# Altium project Capstone_Chess_Board.PrjPcb
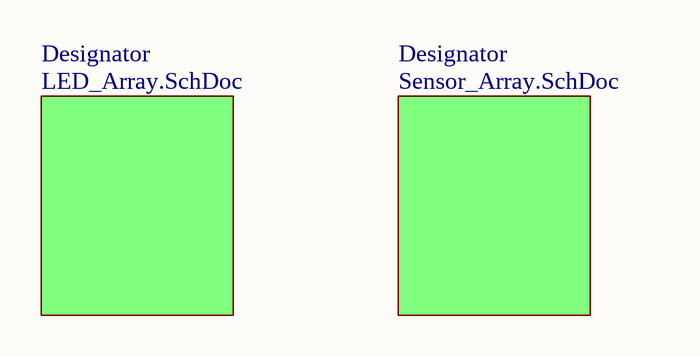
[diagram p0: Power_Supply_And_Connections.SchDoc]
3 sheets, 236 parts. Net scope: flat (ports and power ports of the same name join across sheets).
Board file: Chess_Board.PcbDoc
Sheets:
  Power_Supply_And_Connections.SchDoc
  LED_Array_Large.SchDoc
  Sensor_Array_Large.SchDoc

## Sheet Power_Supply_And_Connections.SchDoc
size A

### Sub-sheets
Designator = LED_Array.SchDoc (file not in this document): no entries
Designator = Sensor_Array.SchDoc (file not in this document): no entries

## Sheet LED_Array_Large.SchDoc
size C
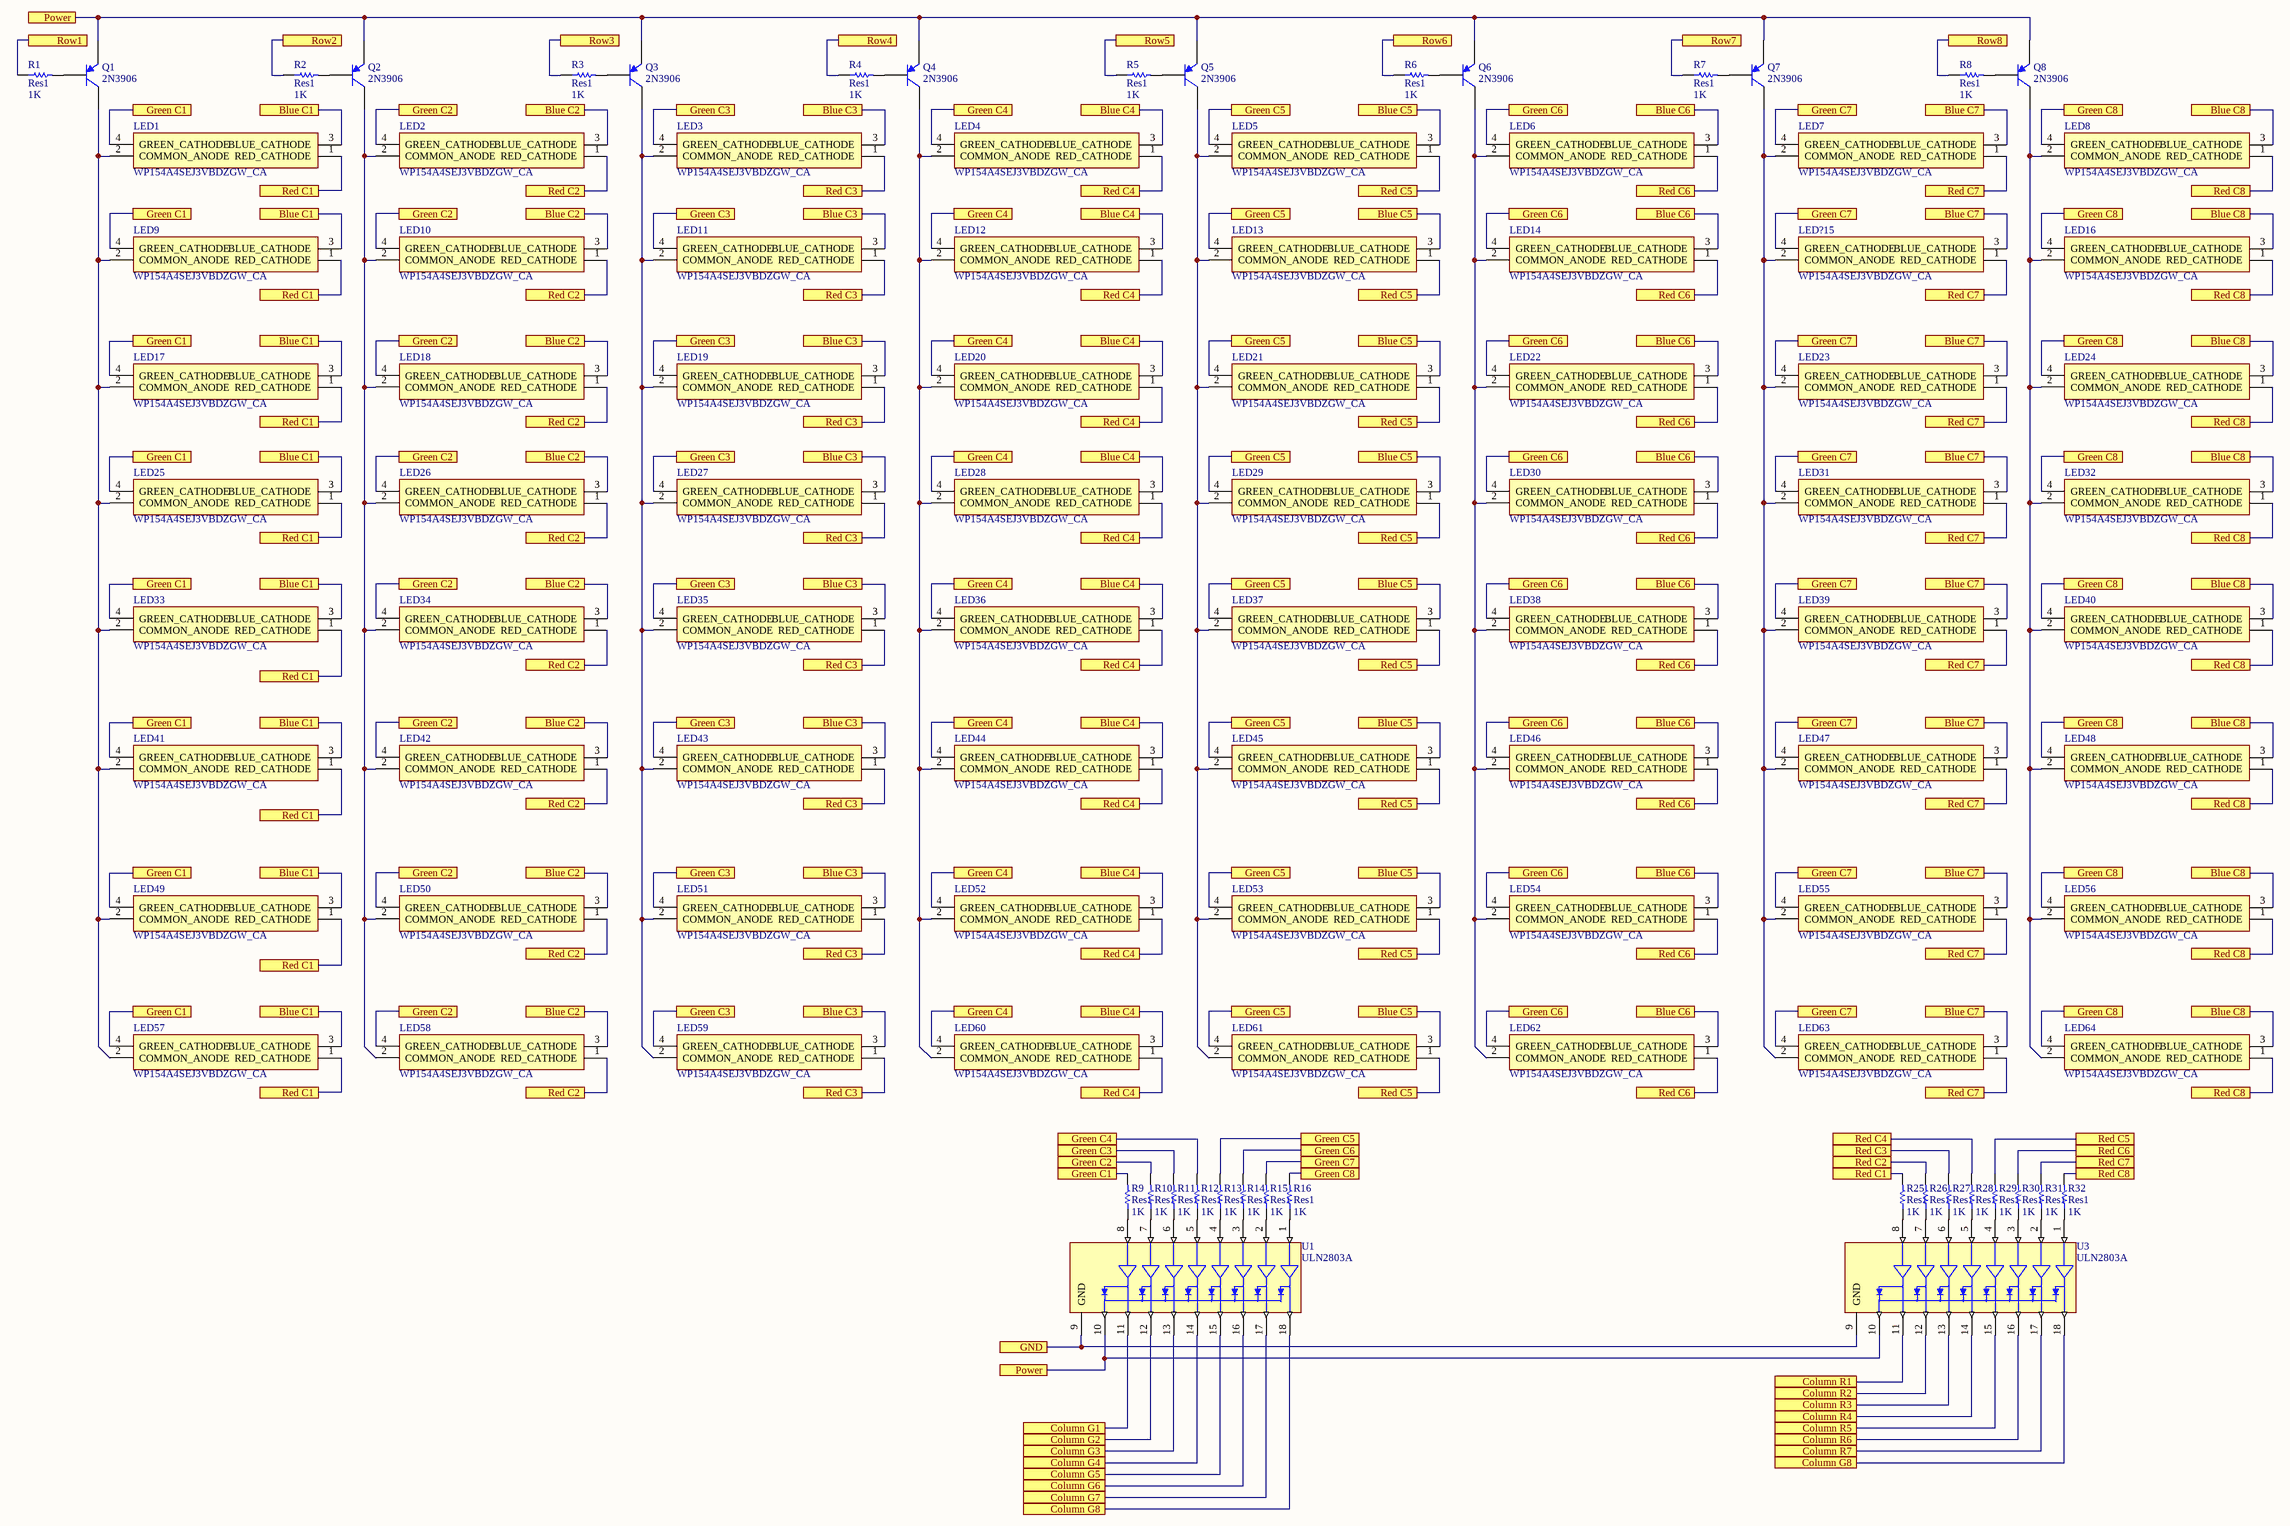
[diagram p1: LED_Array_Large.SchDoc]

### Parts
LED1  WP154A4SEJ3VBDZGW_CA  [L-154A4SUREQBFZGEC]
LED2  WP154A4SEJ3VBDZGW_CA  [L-154A4SUREQBFZGEC]
LED3  WP154A4SEJ3VBDZGW_CA  [L-154A4SUREQBFZGEC]
LED4  WP154A4SEJ3VBDZGW_CA  [L-154A4SUREQBFZGEC]
LED5  WP154A4SEJ3VBDZGW_CA  [L-154A4SUREQBFZGEC]
LED6  WP154A4SEJ3VBDZGW_CA  [L-154A4SUREQBFZGEC]
LED7  WP154A4SEJ3VBDZGW_CA  [L-154A4SUREQBFZGEC]
LED8  WP154A4SEJ3VBDZGW_CA  [L-154A4SUREQBFZGEC]
LED9  WP154A4SEJ3VBDZGW_CA  [L-154A4SUREQBFZGEC]
LED10  WP154A4SEJ3VBDZGW_CA  [L-154A4SUREQBFZGEC]
LED11  WP154A4SEJ3VBDZGW_CA  [L-154A4SUREQBFZGEC]
LED12  WP154A4SEJ3VBDZGW_CA  [L-154A4SUREQBFZGEC]
LED13  WP154A4SEJ3VBDZGW_CA  [L-154A4SUREQBFZGEC]
LED14  WP154A4SEJ3VBDZGW_CA  [L-154A4SUREQBFZGEC]
LED16  WP154A4SEJ3VBDZGW_CA  [L-154A4SUREQBFZGEC]
LED17  WP154A4SEJ3VBDZGW_CA  [L-154A4SUREQBFZGEC]
LED18  WP154A4SEJ3VBDZGW_CA  [L-154A4SUREQBFZGEC]
LED19  WP154A4SEJ3VBDZGW_CA  [L-154A4SUREQBFZGEC]
LED20  WP154A4SEJ3VBDZGW_CA  [L-154A4SUREQBFZGEC]
LED21  WP154A4SEJ3VBDZGW_CA  [L-154A4SUREQBFZGEC]
LED22  WP154A4SEJ3VBDZGW_CA  [L-154A4SUREQBFZGEC]
LED23  WP154A4SEJ3VBDZGW_CA  [L-154A4SUREQBFZGEC]
LED24  WP154A4SEJ3VBDZGW_CA  [L-154A4SUREQBFZGEC]
LED25  WP154A4SEJ3VBDZGW_CA  [L-154A4SUREQBFZGEC]
LED26  WP154A4SEJ3VBDZGW_CA  [L-154A4SUREQBFZGEC]
LED27  WP154A4SEJ3VBDZGW_CA  [L-154A4SUREQBFZGEC]
LED28  WP154A4SEJ3VBDZGW_CA  [L-154A4SUREQBFZGEC]
LED29  WP154A4SEJ3VBDZGW_CA  [L-154A4SUREQBFZGEC]
LED30  WP154A4SEJ3VBDZGW_CA  [L-154A4SUREQBFZGEC]
LED31  WP154A4SEJ3VBDZGW_CA  [L-154A4SUREQBFZGEC]
LED32  WP154A4SEJ3VBDZGW_CA  [L-154A4SUREQBFZGEC]
LED33  WP154A4SEJ3VBDZGW_CA  [L-154A4SUREQBFZGEC]
LED34  WP154A4SEJ3VBDZGW_CA  [L-154A4SUREQBFZGEC]
LED35  WP154A4SEJ3VBDZGW_CA  [L-154A4SUREQBFZGEC]
LED36  WP154A4SEJ3VBDZGW_CA  [L-154A4SUREQBFZGEC]
LED37  WP154A4SEJ3VBDZGW_CA  [L-154A4SUREQBFZGEC]
LED38  WP154A4SEJ3VBDZGW_CA  [L-154A4SUREQBFZGEC]
LED39  WP154A4SEJ3VBDZGW_CA  [L-154A4SUREQBFZGEC]
LED40  WP154A4SEJ3VBDZGW_CA  [L-154A4SUREQBFZGEC]
LED41  WP154A4SEJ3VBDZGW_CA  [L-154A4SUREQBFZGEC]
LED42  WP154A4SEJ3VBDZGW_CA  [L-154A4SUREQBFZGEC]
LED43  WP154A4SEJ3VBDZGW_CA  [L-154A4SUREQBFZGEC]
LED44  WP154A4SEJ3VBDZGW_CA  [L-154A4SUREQBFZGEC]
LED45  WP154A4SEJ3VBDZGW_CA  [L-154A4SUREQBFZGEC]
LED46  WP154A4SEJ3VBDZGW_CA  [L-154A4SUREQBFZGEC]
LED47  WP154A4SEJ3VBDZGW_CA  [L-154A4SUREQBFZGEC]
LED48  WP154A4SEJ3VBDZGW_CA  [L-154A4SUREQBFZGEC]
LED49  WP154A4SEJ3VBDZGW_CA  [L-154A4SUREQBFZGEC]
LED50  WP154A4SEJ3VBDZGW_CA  [L-154A4SUREQBFZGEC]
LED51  WP154A4SEJ3VBDZGW_CA  [L-154A4SUREQBFZGEC]
LED52  WP154A4SEJ3VBDZGW_CA  [L-154A4SUREQBFZGEC]
LED53  WP154A4SEJ3VBDZGW_CA  [L-154A4SUREQBFZGEC]
LED54  WP154A4SEJ3VBDZGW_CA  [L-154A4SUREQBFZGEC]
LED55  WP154A4SEJ3VBDZGW_CA  [L-154A4SUREQBFZGEC]
LED56  WP154A4SEJ3VBDZGW_CA  [L-154A4SUREQBFZGEC]
LED57  WP154A4SEJ3VBDZGW_CA  [L-154A4SUREQBFZGEC]
LED58  WP154A4SEJ3VBDZGW_CA  [L-154A4SUREQBFZGEC]
LED59  WP154A4SEJ3VBDZGW_CA  [L-154A4SUREQBFZGEC]
LED60  WP154A4SEJ3VBDZGW_CA  [L-154A4SUREQBFZGEC]
LED61  WP154A4SEJ3VBDZGW_CA  [L-154A4SUREQBFZGEC]
LED62  WP154A4SEJ3VBDZGW_CA  [L-154A4SUREQBFZGEC]
LED63  WP154A4SEJ3VBDZGW_CA  [L-154A4SUREQBFZGEC]
LED64  WP154A4SEJ3VBDZGW_CA  [L-154A4SUREQBFZGEC]
LED?15  WP154A4SEJ3VBDZGW_CA  [L-154A4SUREQBFZGEC]
Q1  2N3906  [TO-92A]
Q2  2N3906  [TO-92A]
Q3  2N3906  [TO-92A]
Q4  2N3906  [TO-92A]
Q5  2N3906  [TO-92A]
Q6  2N3906  [TO-92A]
Q7  2N3906  [TO-92A]
Q8  2N3906  [TO-92A]
R1  Res1  value 1K  [AXIAL-0.3]
R2  Res1  value 1K  [AXIAL-0.3]
R3  Res1  value 1K  [AXIAL-0.3]
R4  Res1  value 1K  [AXIAL-0.3]
R5  Res1  value 1K  [AXIAL-0.3]
R6  Res1  value 1K  [AXIAL-0.3]
R7  Res1  value 1K  [AXIAL-0.3]
R8  Res1  value 1K  [AXIAL-0.3]
R9  Res1  value 1K  [AXIAL-0.3]
R10  Res1  value 1K  [AXIAL-0.3]
R11  Res1  value 1K  [AXIAL-0.3]
R12  Res1  value 1K  [AXIAL-0.3]
R13  Res1  value 1K  [AXIAL-0.3]
R14  Res1  value 1K  [AXIAL-0.3]
R15  Res1  value 1K  [AXIAL-0.3]
R16  Res1  value 1K  [AXIAL-0.3]
R25  Res1  value 1K  [AXIAL-0.3]
R26  Res1  value 1K  [AXIAL-0.3]
R27  Res1  value 1K  [AXIAL-0.3]
R28  Res1  value 1K  [AXIAL-0.3]
R29  Res1  value 1K  [AXIAL-0.3]
R30  Res1  value 1K  [AXIAL-0.3]
R31  Res1  value 1K  [AXIAL-0.3]
R32  Res1  value 1K  [AXIAL-0.3]
U1  ULN2803A  [DIP850W46P254L2324H393Q18]
U3  ULN2803A  [DIP850W46P254L2324H393Q18]

### Ports
Blue C1, Blue C2, Blue C3, Blue C4, Blue C5, Blue C6, Blue C7, Blue C8, Column G1, Column G2, Column G3, Column G4, Column G5, Column G6, Column G7, Column G8, Column R1, Column R2, Column R3, Column R4, Column R5, Column R6, Column R7, GND, Green C1, Green C2, Green C3, Green C4, Green C5, Green C6, Green C7, Green C8, Power, Red C1, Red C2, Red C3, Red C4, Red C5, Red C6, Red C7, Red C8, Row1, Row2, Row3, Row4, Row5, Row6, Row7, Row8

### Nets
NetLED1_1: LED1.1(RED_CATHODE) LED9.1(RED_CATHODE) LED17.1(RED_CATHODE) LED25.1(RED_CATHODE) LED33.1(RED_CATHODE) LED41.1(RED_CATHODE) LED49.1(RED_CATHODE) LED57.1(RED_CATHODE) R25.2 ; port Red C1
NetLED1_2: LED1.2(COMMON_ANODE) LED9.2(COMMON_ANODE) LED17.2(COMMON_ANODE) LED25.2(COMMON_ANODE) LED33.2(COMMON_ANODE) LED41.2(COMMON_ANODE) LED49.2(COMMON_ANODE) LED57.2(COMMON_ANODE) Q1.3(C)
NetLED1_3: LED1.3(BLUE_CATHODE) LED9.3(BLUE_CATHODE) LED17.3(BLUE_CATHODE) LED25.3(BLUE_CATHODE) LED33.3(BLUE_CATHODE) LED41.3(BLUE_CATHODE) LED49.3(BLUE_CATHODE) LED57.3(BLUE_CATHODE) ; port Blue C1
NetLED1_4: LED1.4(GREEN_CATHODE) LED9.4(GREEN_CATHODE) LED17.4(GREEN_CATHODE) LED25.4(GREEN_CATHODE) LED33.4(GREEN_CATHODE) LED41.4(GREEN_CATHODE) LED49.4(GREEN_CATHODE) LED57.4(GREEN_CATHODE) R9.2 ; port Green C1
NetLED2_1: LED2.1(RED_CATHODE) LED10.1(RED_CATHODE) LED18.1(RED_CATHODE) LED26.1(RED_CATHODE) LED34.1(RED_CATHODE) LED42.1(RED_CATHODE) LED50.1(RED_CATHODE) LED58.1(RED_CATHODE) R26.2 ; port Red C2
NetLED2_2: LED2.2(COMMON_ANODE) LED10.2(COMMON_ANODE) LED18.2(COMMON_ANODE) LED26.2(COMMON_ANODE) LED34.2(COMMON_ANODE) LED42.2(COMMON_ANODE) LED50.2(COMMON_ANODE) LED58.2(COMMON_ANODE) Q2.3(C)
NetLED2_3: LED2.3(BLUE_CATHODE) LED10.3(BLUE_CATHODE) LED18.3(BLUE_CATHODE) LED26.3(BLUE_CATHODE) LED34.3(BLUE_CATHODE) LED42.3(BLUE_CATHODE) LED50.3(BLUE_CATHODE) LED58.3(BLUE_CATHODE) ; port Blue C2
NetLED2_4: LED2.4(GREEN_CATHODE) LED10.4(GREEN_CATHODE) LED18.4(GREEN_CATHODE) LED26.4(GREEN_CATHODE) LED34.4(GREEN_CATHODE) LED42.4(GREEN_CATHODE) LED50.4(GREEN_CATHODE) LED58.4(GREEN_CATHODE) R10.2 ; port Green C2
NetLED3_1: LED3.1(RED_CATHODE) LED11.1(RED_CATHODE) LED19.1(RED_CATHODE) LED27.1(RED_CATHODE) LED35.1(RED_CATHODE) LED43.1(RED_CATHODE) LED51.1(RED_CATHODE) LED59.1(RED_CATHODE) R27.2 ; port Red C3
NetLED3_2: LED3.2(COMMON_ANODE) LED11.2(COMMON_ANODE) LED19.2(COMMON_ANODE) LED27.2(COMMON_ANODE) LED35.2(COMMON_ANODE) LED43.2(COMMON_ANODE) LED51.2(COMMON_ANODE) LED59.2(COMMON_ANODE) Q3.3(C)
NetLED3_3: LED3.3(BLUE_CATHODE) LED11.3(BLUE_CATHODE) LED19.3(BLUE_CATHODE) LED27.3(BLUE_CATHODE) LED35.3(BLUE_CATHODE) LED43.3(BLUE_CATHODE) LED51.3(BLUE_CATHODE) LED59.3(BLUE_CATHODE) ; port Blue C3
NetLED3_4: LED3.4(GREEN_CATHODE) LED11.4(GREEN_CATHODE) LED19.4(GREEN_CATHODE) LED27.4(GREEN_CATHODE) LED35.4(GREEN_CATHODE) LED43.4(GREEN_CATHODE) LED51.4(GREEN_CATHODE) LED59.4(GREEN_CATHODE) R11.2 ; port Green C3
NetLED4_1: LED4.1(RED_CATHODE) LED12.1(RED_CATHODE) LED20.1(RED_CATHODE) LED28.1(RED_CATHODE) LED36.1(RED_CATHODE) LED44.1(RED_CATHODE) LED52.1(RED_CATHODE) LED60.1(RED_CATHODE) R28.2 ; port Red C4
NetLED4_2: LED4.2(COMMON_ANODE) LED12.2(COMMON_ANODE) LED20.2(COMMON_ANODE) LED28.2(COMMON_ANODE) LED36.2(COMMON_ANODE) LED44.2(COMMON_ANODE) LED52.2(COMMON_ANODE) LED60.2(COMMON_ANODE) Q4.3(C)
NetLED4_3: LED4.3(BLUE_CATHODE) LED12.3(BLUE_CATHODE) LED20.3(BLUE_CATHODE) LED28.3(BLUE_CATHODE) LED36.3(BLUE_CATHODE) LED44.3(BLUE_CATHODE) LED52.3(BLUE_CATHODE) LED60.3(BLUE_CATHODE) ; port Blue C4
NetLED4_4: LED4.4(GREEN_CATHODE) LED12.4(GREEN_CATHODE) LED20.4(GREEN_CATHODE) LED28.4(GREEN_CATHODE) LED36.4(GREEN_CATHODE) LED44.4(GREEN_CATHODE) LED52.4(GREEN_CATHODE) LED60.4(GREEN_CATHODE) R12.2 ; port Green C4
NetLED5_1: LED5.1(RED_CATHODE) LED13.1(RED_CATHODE) LED21.1(RED_CATHODE) LED29.1(RED_CATHODE) LED37.1(RED_CATHODE) LED45.1(RED_CATHODE) LED53.1(RED_CATHODE) LED61.1(RED_CATHODE) R29.2 ; port Red C5
NetLED5_2: LED5.2(COMMON_ANODE) LED13.2(COMMON_ANODE) LED21.2(COMMON_ANODE) LED29.2(COMMON_ANODE) LED37.2(COMMON_ANODE) LED45.2(COMMON_ANODE) LED53.2(COMMON_ANODE) LED61.2(COMMON_ANODE) Q5.3(C)
NetLED5_3: LED5.3(BLUE_CATHODE) LED13.3(BLUE_CATHODE) LED21.3(BLUE_CATHODE) LED29.3(BLUE_CATHODE) LED37.3(BLUE_CATHODE) LED45.3(BLUE_CATHODE) LED53.3(BLUE_CATHODE) LED61.3(BLUE_CATHODE) ; port Blue C5
NetLED5_4: LED5.4(GREEN_CATHODE) LED13.4(GREEN_CATHODE) LED21.4(GREEN_CATHODE) LED29.4(GREEN_CATHODE) LED37.4(GREEN_CATHODE) LED45.4(GREEN_CATHODE) LED53.4(GREEN_CATHODE) LED61.4(GREEN_CATHODE) R13.2 ; port Green C5
NetLED6_1: LED6.1(RED_CATHODE) LED14.1(RED_CATHODE) LED22.1(RED_CATHODE) LED30.1(RED_CATHODE) LED38.1(RED_CATHODE) LED46.1(RED_CATHODE) LED54.1(RED_CATHODE) LED62.1(RED_CATHODE) R30.2 ; port Red C6
NetLED6_2: LED6.2(COMMON_ANODE) LED14.2(COMMON_ANODE) LED22.2(COMMON_ANODE) LED30.2(COMMON_ANODE) LED38.2(COMMON_ANODE) LED46.2(COMMON_ANODE) LED54.2(COMMON_ANODE) LED62.2(COMMON_ANODE) Q6.3(C)
NetLED6_3: LED6.3(BLUE_CATHODE) LED14.3(BLUE_CATHODE) LED22.3(BLUE_CATHODE) LED30.3(BLUE_CATHODE) LED38.3(BLUE_CATHODE) LED46.3(BLUE_CATHODE) LED54.3(BLUE_CATHODE) LED62.3(BLUE_CATHODE) ; port Blue C6
NetLED6_4: LED6.4(GREEN_CATHODE) LED14.4(GREEN_CATHODE) LED22.4(GREEN_CATHODE) LED30.4(GREEN_CATHODE) LED38.4(GREEN_CATHODE) LED46.4(GREEN_CATHODE) LED54.4(GREEN_CATHODE) LED62.4(GREEN_CATHODE) R14.2 ; port Green C6
NetLED7_1: LED7.1(RED_CATHODE) LED23.1(RED_CATHODE) LED31.1(RED_CATHODE) LED39.1(RED_CATHODE) LED47.1(RED_CATHODE) LED55.1(RED_CATHODE) LED63.1(RED_CATHODE) LED?15.1(RED_CATHODE) R31.2 ; port Red C7
NetLED7_2: LED7.2(COMMON_ANODE) LED23.2(COMMON_ANODE) LED31.2(COMMON_ANODE) LED39.2(COMMON_ANODE) LED47.2(COMMON_ANODE) LED55.2(COMMON_ANODE) LED63.2(COMMON_ANODE) LED?15.2(COMMON_ANODE) Q7.3(C)
NetLED7_3: LED7.3(BLUE_CATHODE) LED23.3(BLUE_CATHODE) LED31.3(BLUE_CATHODE) LED39.3(BLUE_CATHODE) LED47.3(BLUE_CATHODE) LED55.3(BLUE_CATHODE) LED63.3(BLUE_CATHODE) LED?15.3(BLUE_CATHODE) ; port Blue C7
NetLED7_4: LED7.4(GREEN_CATHODE) LED23.4(GREEN_CATHODE) LED31.4(GREEN_CATHODE) LED39.4(GREEN_CATHODE) LED47.4(GREEN_CATHODE) LED55.4(GREEN_CATHODE) LED63.4(GREEN_CATHODE) LED?15.4(GREEN_CATHODE) R15.2 ; port Green C7
NetLED8_1: LED8.1(RED_CATHODE) LED16.1(RED_CATHODE) LED24.1(RED_CATHODE) LED32.1(RED_CATHODE) LED40.1(RED_CATHODE) LED48.1(RED_CATHODE) LED56.1(RED_CATHODE) LED64.1(RED_CATHODE) R32.2 ; port Red C8
NetLED8_2: LED8.2(COMMON_ANODE) LED16.2(COMMON_ANODE) LED24.2(COMMON_ANODE) LED32.2(COMMON_ANODE) LED40.2(COMMON_ANODE) LED48.2(COMMON_ANODE) LED56.2(COMMON_ANODE) LED64.2(COMMON_ANODE) Q8.3(C)
NetLED8_3: LED8.3(BLUE_CATHODE) LED16.3(BLUE_CATHODE) LED24.3(BLUE_CATHODE) LED32.3(BLUE_CATHODE) LED40.3(BLUE_CATHODE) LED48.3(BLUE_CATHODE) LED56.3(BLUE_CATHODE) LED64.3(BLUE_CATHODE) ; port Blue C8
NetLED8_4: LED8.4(GREEN_CATHODE) LED16.4(GREEN_CATHODE) LED24.4(GREEN_CATHODE) LED32.4(GREEN_CATHODE) LED40.4(GREEN_CATHODE) LED48.4(GREEN_CATHODE) LED56.4(GREEN_CATHODE) LED64.4(GREEN_CATHODE) R16.2 ; port Green C8
NetQ1_1: Q1.1(E) Q2.1(E) Q3.1(E) Q4.1(E) Q5.1(E) Q6.1(E) Q7.1(E) Q8.1(E) U1.10(COMMON) U3.10(COMMON) ; port Power
NetQ1_2: Q1.2(B) R1.2
NetQ2_2: Q2.2(B) R2.2
NetQ3_2: Q3.2(B) R3.2
NetQ4_2: Q4.2(B) R4.2
NetQ5_2: Q5.2(B) R5.2
NetQ6_2: Q6.2(B) R6.2
NetQ7_2: Q7.2(B) R7.2
NetQ8_2: Q8.2(B) R8.2
NetR1_1: R1.1 ; port Row1
NetR2_1: R2.1 ; port Row2
NetR3_1: R3.1 ; port Row3
NetR4_1: R4.1 ; port Row4
NetR5_1: R5.1 ; port Row5
NetR6_1: R6.1 ; port Row6
NetR7_1: R7.1 ; port Row7
NetR8_1: R8.1 ; port Row8
NetR9_1: R9.1 U1.8(IN_8)
NetR10_1: R10.1 U1.7(IN_7)
NetR11_1: R11.1 U1.6(IN_6)
NetR12_1: R12.1 U1.5(IN_5)
NetR13_1: R13.1 U1.4(IN_4)
NetR14_1: R14.1 U1.3(IN_3)
NetR15_1: R15.1 U1.2(IN_2)
NetR16_1: R16.1 U1.1(IN_1)
NetR25_1: R25.1 U3.8(IN_8)
NetR26_1: R26.1 U3.7(IN_7)
NetR27_1: R27.1 U3.6(IN_6)
NetR28_1: R28.1 U3.5(IN_5)
NetR29_1: R29.1 U3.4(IN_4)
NetR30_1: R30.1 U3.3(IN_3)
NetR31_1: R31.1 U3.2(IN_2)
NetR32_1: R32.1 U3.1(IN_1)
NetU1_9: U1.9(GND) U3.9(GND) ; port GND
NetU1_11: U1.11(OUT_8) ; port Column G1
NetU1_12: U1.12(OUT_7) ; port Column G2
NetU1_13: U1.13(OUT_6) ; port Column G3
NetU1_14: U1.14(OUT_5) ; port Column G4
NetU1_15: U1.15(OUT_4) ; port Column G5
NetU1_16: U1.16(OUT_3) ; port Column G6
NetU1_17: U1.17(OUT_2) ; port Column G7
NetU1_18: U1.18(OUT_1) U3.18(OUT_1) ; port Column G8
NetU3_11: U3.11(OUT_8) ; port Column R1
NetU3_12: U3.12(OUT_7) ; port Column R2
NetU3_13: U3.13(OUT_6) ; port Column R3
NetU3_14: U3.14(OUT_5) ; port Column R4
NetU3_15: U3.15(OUT_4) ; port Column R5
NetU3_16: U3.16(OUT_3) ; port Column R6
NetU3_17: U3.17(OUT_2) ; port Column R7

### Library data of the parts
LED1-LED14 LED16-LED64 LED?15 = WP154A4SEJ3VBDZGW_CA: LED; Manufacturer_Name: Kingbright; Manufacturer_Part_Number: WP154A4SEJ3VBDZGW/CA; Datasheet Link: http://www.kingbrightusa.com/images/catalog/SPEC/WP154A4SEJ3VBDZGW-CA.pdf; Mouser Part Number: 604-WP154A43VBDZGWCA; Mouser Price/Stock: https://www.mouser.co.uk/ProductDetail/Kingbright/WP154A4SEJ3VBDZGW-CA/?qs=YCa%2FAAYMW01xRqZww6UuiQ%3D%3D; Arrow Part Number: WP154A4SEJ3VBDZGW/CA; Arrow Price/Stock: https://www.arrow.com/en/products/wp154a4sej3vbdzgwca/kingbright
Q1-Q8 = 2N3906: PNP General Purpose Amplifier; Published: 8-Jun-2000; LatestRevisionDate: 15-Jan-2003; LatestRevisionNote: PCB Footprint 'BCY-W3/D4.7' replaced; DatasheetVersion: 1997; PackageVersion: Sep-1998; PackageReference: TO-92A; Publisher: Altium Limited; PackageDescription: TO, Flat Index; 3 In-Line, Axial Leads; Body Dia. 4.5mm; Leads 0.51 x 0.48 mm (max); ComponentLink1Description: Manufacturer Link; ComponentLink1URL: http://www.fairchildsemi.com/; ComponentLink2Description: Datasheet; ComponentLink2URL: http://www.fairchildsemi.com/ds/2N%2F2N3906.pdf
R1-R16 R25-R32 = Res1: Resistor; Published: 8-Jun-2000; LatestRevisionDate: 17-Jul-2002; LatestRevisionNote: Re-released for DXP Platform.; PackageReference: AXIAL-0.3; Publisher: Altium Limited; PackageDescription: Axial Device, Thru-Hole; 2 Leads; 0.3 in Pin Spacing
U1 U3 = ULN2803A: Bipolar _BJT_ Transistor Array 8 NPN Darlington 50V 500mA 2.25W Through Hole 18-DIP; MF: STMicroelectronics; Value: *; MP: ULN2803A; Package: DIP-18 STMicroelectronics; Price: None; SnapEDA_Link: https://www.snapeda.com/parts/ULN2803A/STMicroelectronics/view-part/697285/?ref=snap; Availability: Unavailable

## Sheet Sensor_Array_Large.SchDoc
size C
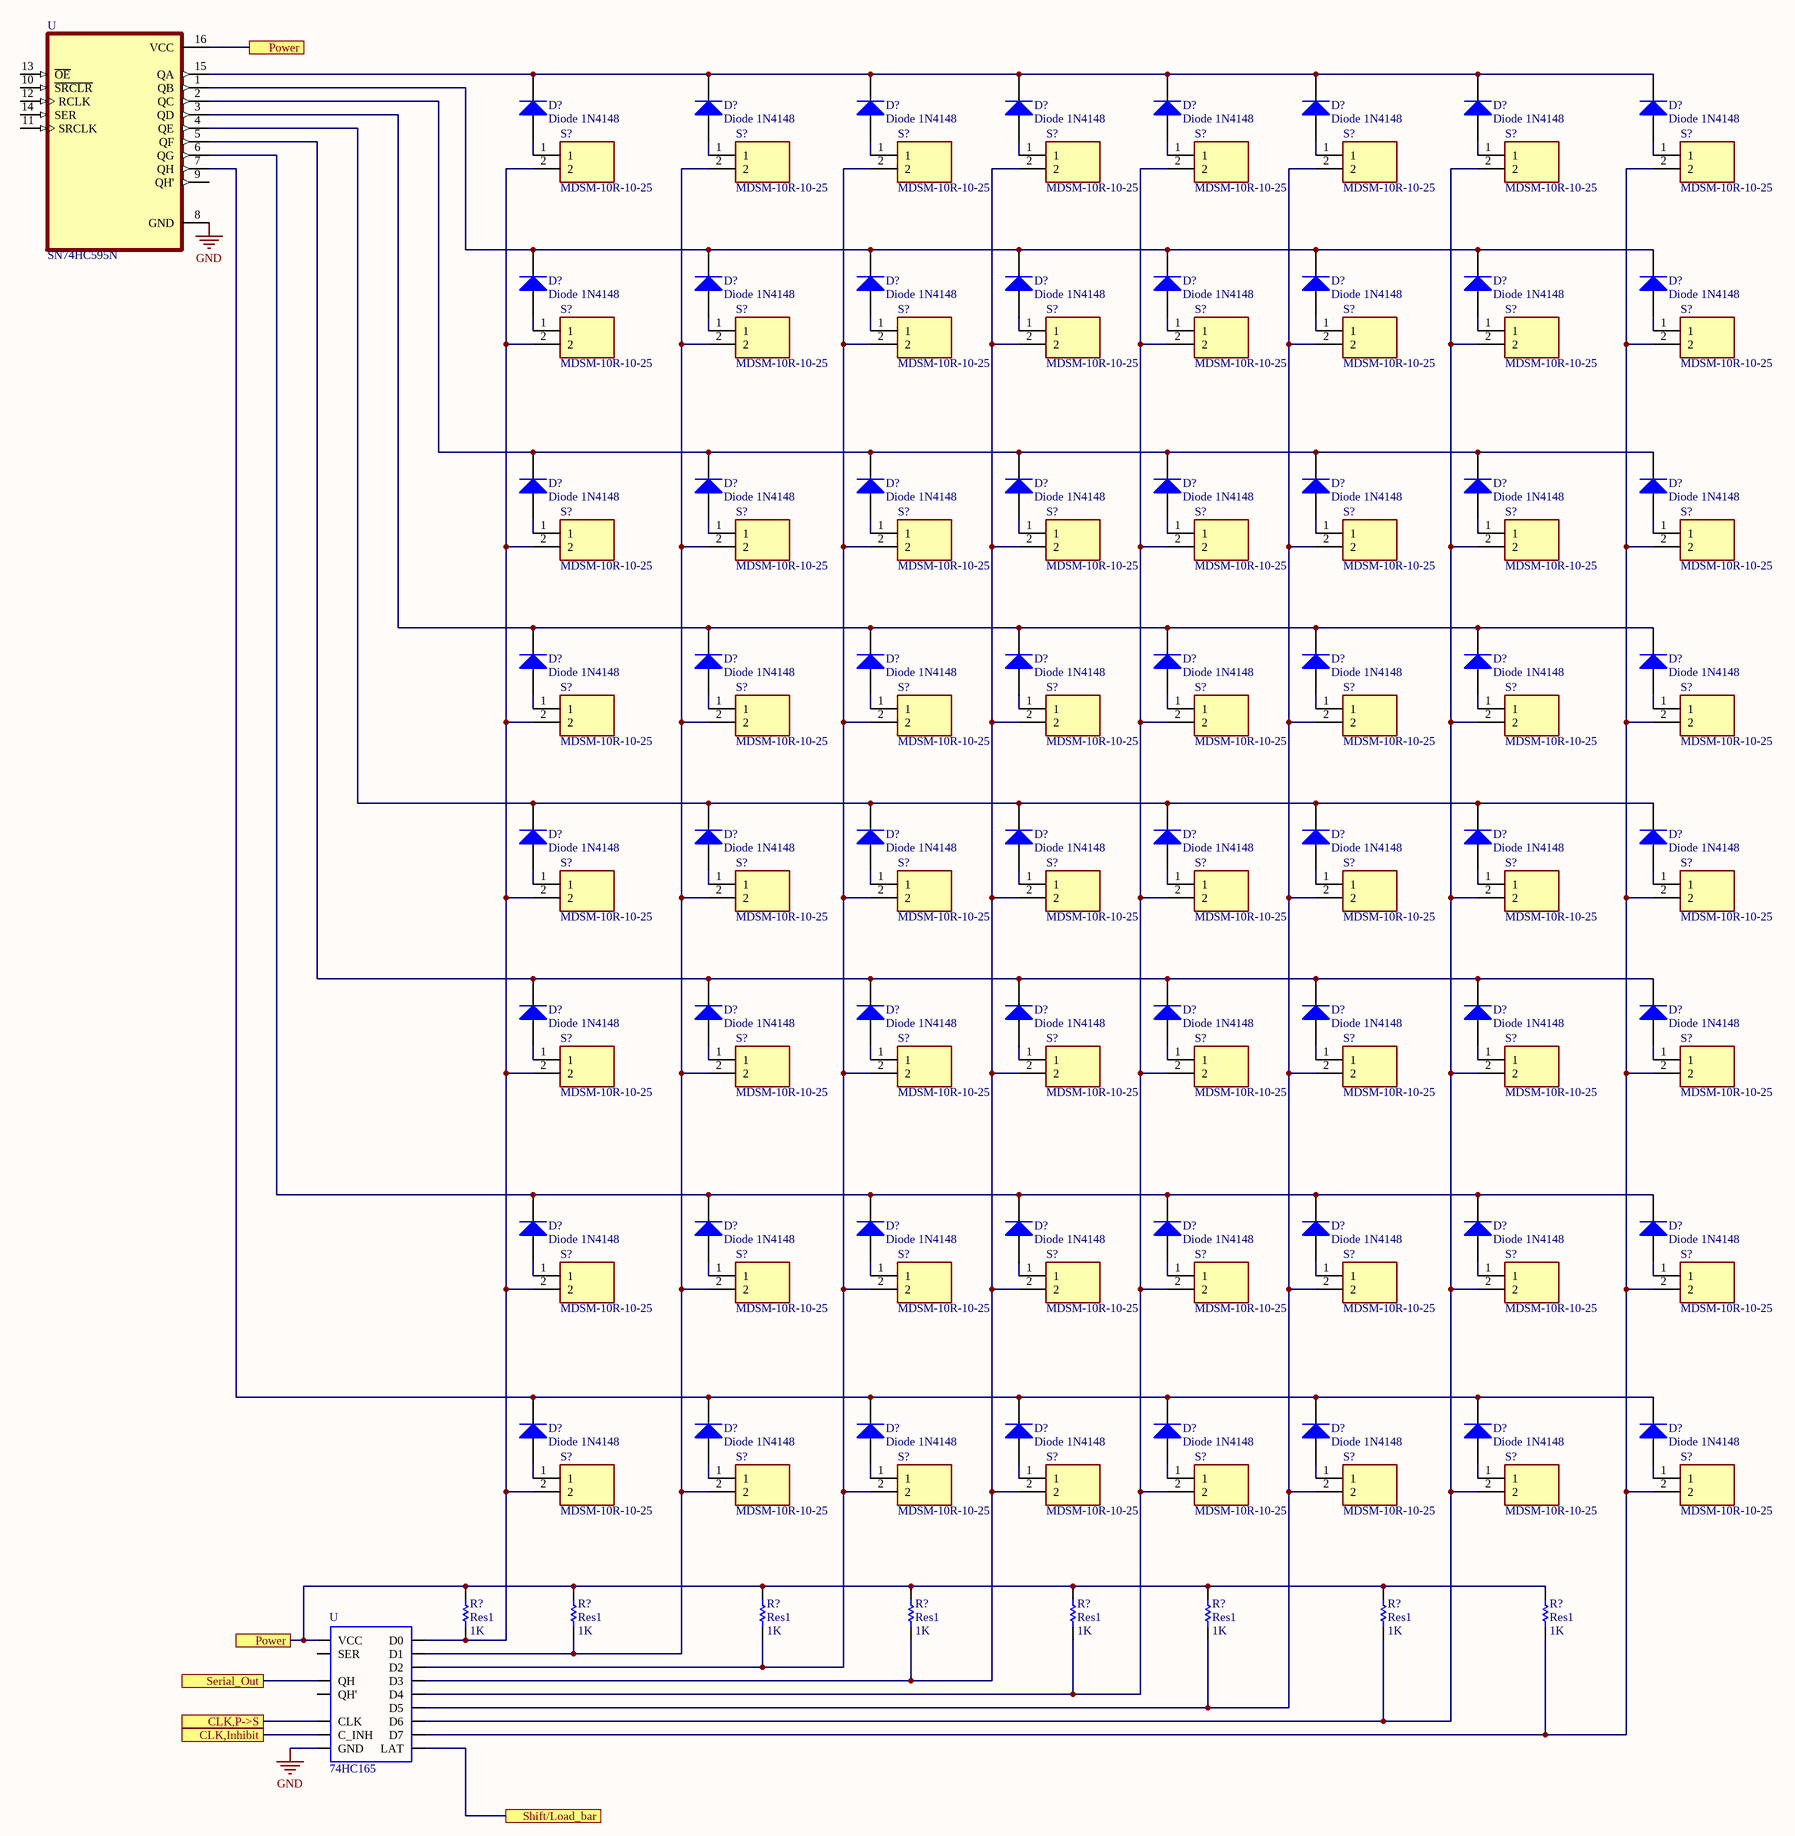
[diagram p2: Sensor_Array_Large.SchDoc]

### Parts
(Parts that share a designator on the sheet are numbered #1, #2 ... from top to bottom, then left to right.)
D?#1  Diode 1N4148  [DO-35]
D?#2  Diode 1N4148  [DO-35]
D?#3  Diode 1N4148  [DO-35]
D?#4  Diode 1N4148  [DO-35]
D?#5  Diode 1N4148  [DO-35]
D?#6  Diode 1N4148  [DO-35]
D?#7  Diode 1N4148  [DO-35]
D?#8  Diode 1N4148  [DO-35]
D?#9  Diode 1N4148  [DO-35]
D?#10  Diode 1N4148  [DO-35]
D?#11  Diode 1N4148  [DO-35]
D?#12  Diode 1N4148  [DO-35]
D?#13  Diode 1N4148  [DO-35]
D?#14  Diode 1N4148  [DO-35]
D?#15  Diode 1N4148  [DO-35]
D?#16  Diode 1N4148  [DO-35]
D?#17  Diode 1N4148  [DO-35]
D?#18  Diode 1N4148  [DO-35]
D?#19  Diode 1N4148  [DO-35]
D?#20  Diode 1N4148  [DO-35]
D?#21  Diode 1N4148  [DO-35]
D?#22  Diode 1N4148  [DO-35]
D?#23  Diode 1N4148  [DO-35]
D?#24  Diode 1N4148  [DO-35]
D?#25  Diode 1N4148  [DO-35]
D?#26  Diode 1N4148  [DO-35]
D?#27  Diode 1N4148  [DO-35]
D?#28  Diode 1N4148  [DO-35]
D?#29  Diode 1N4148  [DO-35]
D?#30  Diode 1N4148  [DO-35]
D?#31  Diode 1N4148  [DO-35]
D?#32  Diode 1N4148  [DO-35]
D?#33  Diode 1N4148  [DO-35]
D?#34  Diode 1N4148  [DO-35]
D?#35  Diode 1N4148  [DO-35]
D?#36  Diode 1N4148  [DO-35]
D?#37  Diode 1N4148  [DO-35]
D?#38  Diode 1N4148  [DO-35]
D?#39  Diode 1N4148  [DO-35]
D?#40  Diode 1N4148  [DO-35]
D?#41  Diode 1N4148  [DO-35]
D?#42  Diode 1N4148  [DO-35]
D?#43  Diode 1N4148  [DO-35]
D?#44  Diode 1N4148  [DO-35]
D?#45  Diode 1N4148  [DO-35]
D?#46  Diode 1N4148  [DO-35]
D?#47  Diode 1N4148  [DO-35]
D?#48  Diode 1N4148  [DO-35]
D?#49  Diode 1N4148  [DO-35]
D?#50  Diode 1N4148  [DO-35]
D?#51  Diode 1N4148  [DO-35]
D?#52  Diode 1N4148  [DO-35]
D?#53  Diode 1N4148  [DO-35]
D?#54  Diode 1N4148  [DO-35]
D?#55  Diode 1N4148  [DO-35]
D?#56  Diode 1N4148  [DO-35]
D?#57  Diode 1N4148  [DO-35]
D?#58  Diode 1N4148  [DO-35]
D?#59  Diode 1N4148  [DO-35]
D?#60  Diode 1N4148  [DO-35]
D?#61  Diode 1N4148  [DO-35]
D?#62  Diode 1N4148  [DO-35]
D?#63  Diode 1N4148  [DO-35]
D?#64  Diode 1N4148  [DO-35]
R?#1  Res1  value 1K  [AXIAL-0.3]
R?#2  Res1  value 1K  [AXIAL-0.3]
R?#3  Res1  value 1K  [AXIAL-0.3]
R?#4  Res1  value 1K  [AXIAL-0.3]
R?#5  Res1  value 1K  [AXIAL-0.3]
R?#6  Res1  value 1K  [AXIAL-0.3]
R?#7  Res1  value 1K  [AXIAL-0.3]
R?#8  Res1  value 1K  [AXIAL-0.3]
S?#1  MDSM-10R-10-25  [MDSM10R1025]
S?#2  MDSM-10R-10-25  [MDSM10R1025]
S?#3  MDSM-10R-10-25  [MDSM10R1025]
S?#4  MDSM-10R-10-25  [MDSM10R1025]
S?#5  MDSM-10R-10-25  [MDSM10R1025]
S?#6  MDSM-10R-10-25  [MDSM10R1025]
S?#7  MDSM-10R-10-25  [MDSM10R1025]
S?#8  MDSM-10R-10-25  [MDSM10R1025]
S?#9  MDSM-10R-10-25  [MDSM10R1025]
S?#10  MDSM-10R-10-25  [MDSM10R1025]
S?#11  MDSM-10R-10-25  [MDSM10R1025]
S?#12  MDSM-10R-10-25  [MDSM10R1025]
S?#13  MDSM-10R-10-25  [MDSM10R1025]
S?#14  MDSM-10R-10-25  [MDSM10R1025]
S?#15  MDSM-10R-10-25  [MDSM10R1025]
S?#16  MDSM-10R-10-25  [MDSM10R1025]
S?#17  MDSM-10R-10-25  [MDSM10R1025]
S?#18  MDSM-10R-10-25  [MDSM10R1025]
S?#19  MDSM-10R-10-25  [MDSM10R1025]
S?#20  MDSM-10R-10-25  [MDSM10R1025]
S?#21  MDSM-10R-10-25  [MDSM10R1025]
S?#22  MDSM-10R-10-25  [MDSM10R1025]
S?#23  MDSM-10R-10-25  [MDSM10R1025]
S?#24  MDSM-10R-10-25  [MDSM10R1025]
S?#25  MDSM-10R-10-25  [MDSM10R1025]
S?#26  MDSM-10R-10-25  [MDSM10R1025]
S?#27  MDSM-10R-10-25  [MDSM10R1025]
S?#28  MDSM-10R-10-25  [MDSM10R1025]
S?#29  MDSM-10R-10-25  [MDSM10R1025]
S?#30  MDSM-10R-10-25  [MDSM10R1025]
S?#31  MDSM-10R-10-25  [MDSM10R1025]
S?#32  MDSM-10R-10-25  [MDSM10R1025]
S?#33  MDSM-10R-10-25  [MDSM10R1025]
S?#34  MDSM-10R-10-25  [MDSM10R1025]
S?#35  MDSM-10R-10-25  [MDSM10R1025]
S?#36  MDSM-10R-10-25  [MDSM10R1025]
S?#37  MDSM-10R-10-25  [MDSM10R1025]
S?#38  MDSM-10R-10-25  [MDSM10R1025]
S?#39  MDSM-10R-10-25  [MDSM10R1025]
S?#40  MDSM-10R-10-25  [MDSM10R1025]
S?#41  MDSM-10R-10-25  [MDSM10R1025]
S?#42  MDSM-10R-10-25  [MDSM10R1025]
S?#43  MDSM-10R-10-25  [MDSM10R1025]
S?#44  MDSM-10R-10-25  [MDSM10R1025]
S?#45  MDSM-10R-10-25  [MDSM10R1025]
S?#46  MDSM-10R-10-25  [MDSM10R1025]
S?#47  MDSM-10R-10-25  [MDSM10R1025]
S?#48  MDSM-10R-10-25  [MDSM10R1025]
S?#49  MDSM-10R-10-25  [MDSM10R1025]
S?#50  MDSM-10R-10-25  [MDSM10R1025]
S?#51  MDSM-10R-10-25  [MDSM10R1025]
S?#52  MDSM-10R-10-25  [MDSM10R1025]
S?#53  MDSM-10R-10-25  [MDSM10R1025]
S?#54  MDSM-10R-10-25  [MDSM10R1025]
S?#55  MDSM-10R-10-25  [MDSM10R1025]
S?#56  MDSM-10R-10-25  [MDSM10R1025]
S?#57  MDSM-10R-10-25  [MDSM10R1025]
S?#58  MDSM-10R-10-25  [MDSM10R1025]
S?#59  MDSM-10R-10-25  [MDSM10R1025]
S?#60  MDSM-10R-10-25  [MDSM10R1025]
S?#61  MDSM-10R-10-25  [MDSM10R1025]
S?#62  MDSM-10R-10-25  [MDSM10R1025]
S?#63  MDSM-10R-10-25  [MDSM10R1025]
S?#64  MDSM-10R-10-25  [MDSM10R1025]
U#1  SN74HC595N  [DIP794W45P254L1969H508Q16]
U#2  74HC165  [SO-16]

### Ports
CLK,Inhibit, CLK,P->S, Power, Serial_Out, Shift/Load_bar

### Nets
GND: U#1.8(GND) U#2.8(GND)
NetD?#1_1: D?#1.1(A) S?#1.1
NetD?#1_2: D?#1.2(K) D?#2.2(K) D?#3.2(K) D?#4.2(K) D?#5.2(K) D?#6.2(K) D?#7.2(K) D?#8.2(K) U#1.15(QA)
NetD?#2_1: D?#2.1(A) S?#2.1
NetD?#3_1: D?#3.1(A) S?#3.1
NetD?#4_1: D?#4.1(A) S?#4.1
NetD?#5_1: D?#5.1(A) S?#5.1
NetD?#6_1: D?#6.1(A) S?#6.1
NetD?#7_1: D?#7.1(A) S?#7.1
NetD?#8_1: D?#8.1(A) S?#8.1
NetD?#9_1: D?#9.1(A) S?#9.1
NetD?#9_2: D?#9.2(K) D?#10.2(K) D?#11.2(K) D?#12.2(K) D?#13.2(K) D?#14.2(K) D?#15.2(K) D?#16.2(K) U#1.1(QB)
NetD?#10_1: D?#10.1(A) S?#10.1
NetD?#11_1: D?#11.1(A) S?#11.1
NetD?#12_1: D?#12.1(A) S?#12.1
NetD?#13_1: D?#13.1(A) S?#13.1
NetD?#14_1: D?#14.1(A) S?#14.1
NetD?#15_1: D?#15.1(A) S?#15.1
NetD?#16_1: D?#16.1(A) S?#16.1
NetD?#17_1: D?#17.1(A) S?#17.1
NetD?#17_2: D?#17.2(K) D?#18.2(K) D?#19.2(K) D?#20.2(K) D?#21.2(K) D?#22.2(K) D?#23.2(K) D?#24.2(K) U#1.2(QC)
NetD?#18_1: D?#18.1(A) S?#18.1
NetD?#19_1: D?#19.1(A) S?#19.1
NetD?#20_1: D?#20.1(A) S?#20.1
NetD?#21_1: D?#21.1(A) S?#21.1
NetD?#22_1: D?#22.1(A) S?#22.1
NetD?#23_1: D?#23.1(A) S?#23.1
NetD?#24_1: D?#24.1(A) S?#24.1
NetD?#25_1: D?#25.1(A) S?#25.1
NetD?#25_2: D?#25.2(K) D?#26.2(K) D?#27.2(K) D?#28.2(K) D?#29.2(K) D?#30.2(K) D?#31.2(K) D?#32.2(K) U#1.3(QD)
NetD?#26_1: D?#26.1(A) S?#26.1
NetD?#27_1: D?#27.1(A) S?#27.1
NetD?#28_1: D?#28.1(A) S?#28.1
NetD?#29_1: D?#29.1(A) S?#29.1
NetD?#30_1: D?#30.1(A) S?#30.1
NetD?#31_1: D?#31.1(A) S?#31.1
NetD?#32_1: D?#32.1(A) S?#32.1
NetD?#33_1: D?#33.1(A) S?#33.1
NetD?#33_2: D?#33.2(K) D?#34.2(K) D?#35.2(K) D?#36.2(K) D?#37.2(K) D?#38.2(K) D?#39.2(K) D?#40.2(K) U#1.4(QE)
NetD?#34_1: D?#34.1(A) S?#34.1
NetD?#35_1: D?#35.1(A) S?#35.1
NetD?#36_1: D?#36.1(A) S?#36.1
NetD?#37_1: D?#37.1(A) S?#37.1
NetD?#38_1: D?#38.1(A) S?#38.1
NetD?#39_1: D?#39.1(A) S?#39.1
NetD?#40_1: D?#40.1(A) S?#40.1
NetD?#41_1: D?#41.1(A) S?#41.1
NetD?#41_2: D?#41.2(K) D?#42.2(K) D?#43.2(K) D?#44.2(K) D?#45.2(K) D?#46.2(K) D?#47.2(K) D?#48.2(K) U#1.5(QF)
NetD?#42_1: D?#42.1(A) S?#42.1
NetD?#43_1: D?#43.1(A) S?#43.1
NetD?#44_1: D?#44.1(A) S?#44.1
NetD?#45_1: D?#45.1(A) S?#45.1
NetD?#46_1: D?#46.1(A) S?#46.1
NetD?#47_1: D?#47.1(A) S?#47.1
NetD?#48_1: D?#48.1(A) S?#48.1
NetD?#49_1: D?#49.1(A) S?#49.1
NetD?#49_2: D?#49.2(K) D?#50.2(K) D?#51.2(K) D?#52.2(K) D?#53.2(K) D?#54.2(K) D?#55.2(K) D?#56.2(K) U#1.6(QG)
NetD?#50_1: D?#50.1(A) S?#50.1
NetD?#51_1: D?#51.1(A) S?#51.1
NetD?#52_1: D?#52.1(A) S?#52.1
NetD?#53_1: D?#53.1(A) S?#53.1
NetD?#54_1: D?#54.1(A) S?#54.1
NetD?#55_1: D?#55.1(A) S?#55.1
NetD?#56_1: D?#56.1(A) S?#56.1
NetD?#57_1: D?#57.1(A) S?#57.1
NetD?#57_2: D?#57.2(K) D?#58.2(K) D?#59.2(K) D?#60.2(K) D?#61.2(K) D?#62.2(K) D?#63.2(K) D?#64.2(K) U#1.7(QH)
NetD?#58_1: D?#58.1(A) S?#58.1
NetD?#59_1: D?#59.1(A) S?#59.1
NetD?#60_1: D?#60.1(A) S?#60.1
NetD?#61_1: D?#61.1(A) S?#61.1
NetD?#62_1: D?#62.1(A) S?#62.1
NetD?#63_1: D?#63.1(A) S?#63.1
NetD?#64_1: D?#64.1(A) S?#64.1
NetQ1_1: R?#1.2 R?#2.2 R?#3.2 R?#4.2 R?#5.2 R?#6.2 R?#7.2 R?#8.2 U#1.16(VCC) U#2.16(VCC) ; port Power
NetR?#1_1: R?#1.1 S?#1.2 S?#9.2 S?#17.2 S?#25.2 S?#33.2 S?#41.2 S?#49.2 S?#57.2 U#2.11(D0)
NetR?#2_1: R?#2.1 S?#2.2 S?#10.2 S?#18.2 S?#26.2 S?#34.2 S?#42.2 S?#50.2 S?#58.2 U#2.12(D1)
NetR?#3_1: R?#3.1 S?#3.2 S?#11.2 S?#19.2 S?#27.2 S?#35.2 S?#43.2 S?#51.2 S?#59.2 U#2.13(D2)
NetR?#4_1: R?#4.1 S?#4.2 S?#12.2 S?#20.2 S?#28.2 S?#36.2 S?#44.2 S?#52.2 S?#60.2 U#2.14(D3)
NetR?#5_1: R?#5.1 S?#5.2 S?#13.2 S?#21.2 S?#29.2 S?#37.2 S?#45.2 S?#53.2 S?#61.2 U#2.3(D4)
NetR?#6_1: R?#6.1 S?#6.2 S?#14.2 S?#22.2 S?#30.2 S?#38.2 S?#46.2 S?#54.2 S?#62.2 U#2.4(D5)
NetR?#7_1: R?#7.1 S?#7.2 S?#15.2 S?#23.2 S?#31.2 S?#39.2 S?#47.2 S?#55.2 S?#63.2 U#2.5(D6)
NetR?#8_1: R?#8.1 S?#8.2 S?#16.2 S?#24.2 S?#32.2 S?#40.2 S?#48.2 S?#56.2 S?#64.2 U#2.6(D7)
NetU#2_1: U#2.1(LAT) ; port Shift/Load_bar
NetU#2_2: U#2.2(CLK) ; port CLK,P->S
NetU#2_9: U#2.9(QH) ; port Serial_Out
NetU#2_15: U#2.15(C_INH) ; port CLK,Inhibit

Not connected (* = marked no-connect by the designer): U#1 9(QH') 10(~{SRCLR}) 11(SRCLK) 12(RCLK) 13(~{OE}) 14(SER); U#2 7(QH') 10(SER)

### Library data of the parts
D?#1-D?#64 = Diode 1N4148: High Conductance Fast Diode; Published: 8-Jun-2000; LatestRevisionDate: 17-Jul-2002; LatestRevisionNote: Re-released for DXP Platform.; DatasheetVersion: 1997; PackageReference: DO-35; Publisher: Altium Limited; PackageDescription: Diode, Axial; Body 3.8 x 1.9 mm (LxDia. max), Lead Dia. 0.53 mm (max); Code_JEDEC: DO-204-AH; ComponentLink1Description: Manufacturer Link; ComponentLink1URL: http://www.fairchildsemi.com/; ComponentLink2Description: Datasheet; ComponentLink2URL: http://www.fairchildsemi.com/ds/1N%2F1N4148.pdf
R?#1-R?#8 = Res1: Resistor; Published: 8-Jun-2000; LatestRevisionDate: 17-Jul-2002; LatestRevisionNote: Re-released for DXP Platform.; PackageReference: AXIAL-0.3; Publisher: Altium Limited; PackageDescription: Axial Device, Thru-Hole; 2 Leads; 0.3 in Pin Spacing
S?#1-S?#64 = MDSM-10R-10-25: Switch; Manufacturer_Name: LITTELFUSE; Description: Magnetic / Reed Switches SWITCH REED; Datasheet Link: https://www.littelfuse.com/~/media/electronics/datasheets/reed_switches/littelfuse_reed_switches_mdsm_10_datasheet.pdf.pdf; Height: 2mm; Manufacturer_Part_Number: MDSM-10R-10-25; Mouser Part Number: 934-MDSM-10R10-25; Mouser Price/Stock: https://www.mouser.co.uk/ProductDetail/Littelfuse/MDSM-10R-10-25?qs=nyo4TFax6Nce6Y4AmbWmcw%3D%3D; Arrow Part Number: MDSM-10R-10-25; Arrow Price/Stock: https://www.arrow.com/en/products/mdsm-10r-10-25/littelfuse
U#1 = SN74HC595N: 8-bit shift registers with 3-state output registers 16-PDIP -40 to 85; MF: Texas Instruments; MP: SN74HC595N; Price: None; Package: PDIP-16 Texas Instruments; Texas_Instruments-Purchase-URL: https://snapeda.com/shop?store=Texas+Instruments&id=2479486; Value: *; Availability: Unavailable; SnapEDA_Link: https://www.snapeda.com/parts/SN74HC595N/Texas%20Instruments/view-part/2479486/?ref=snap
U#2 = 74HC165: Shift Shift Register 1 Element 8 Bit 16-SO; MF: Nexperia USA; SnapEDA_Link: https://www.snapeda.com/parts/74HC165/Nexperia%20USA%20Inc./view-part/560686/?ref=snap; Availability: Unavailable; Price: None; Package: VFQFN-16 STMicroelectronics; MP: 74HC165; Value: *

## Nets that join several sheets
NetQ1_1: LED_Array_Large (10 pins), Sensor_Array_Large (10 pins)